# EasyEDA Pro project ProPrj_Anniversary_2026-05-06.epro, board PCB1_1
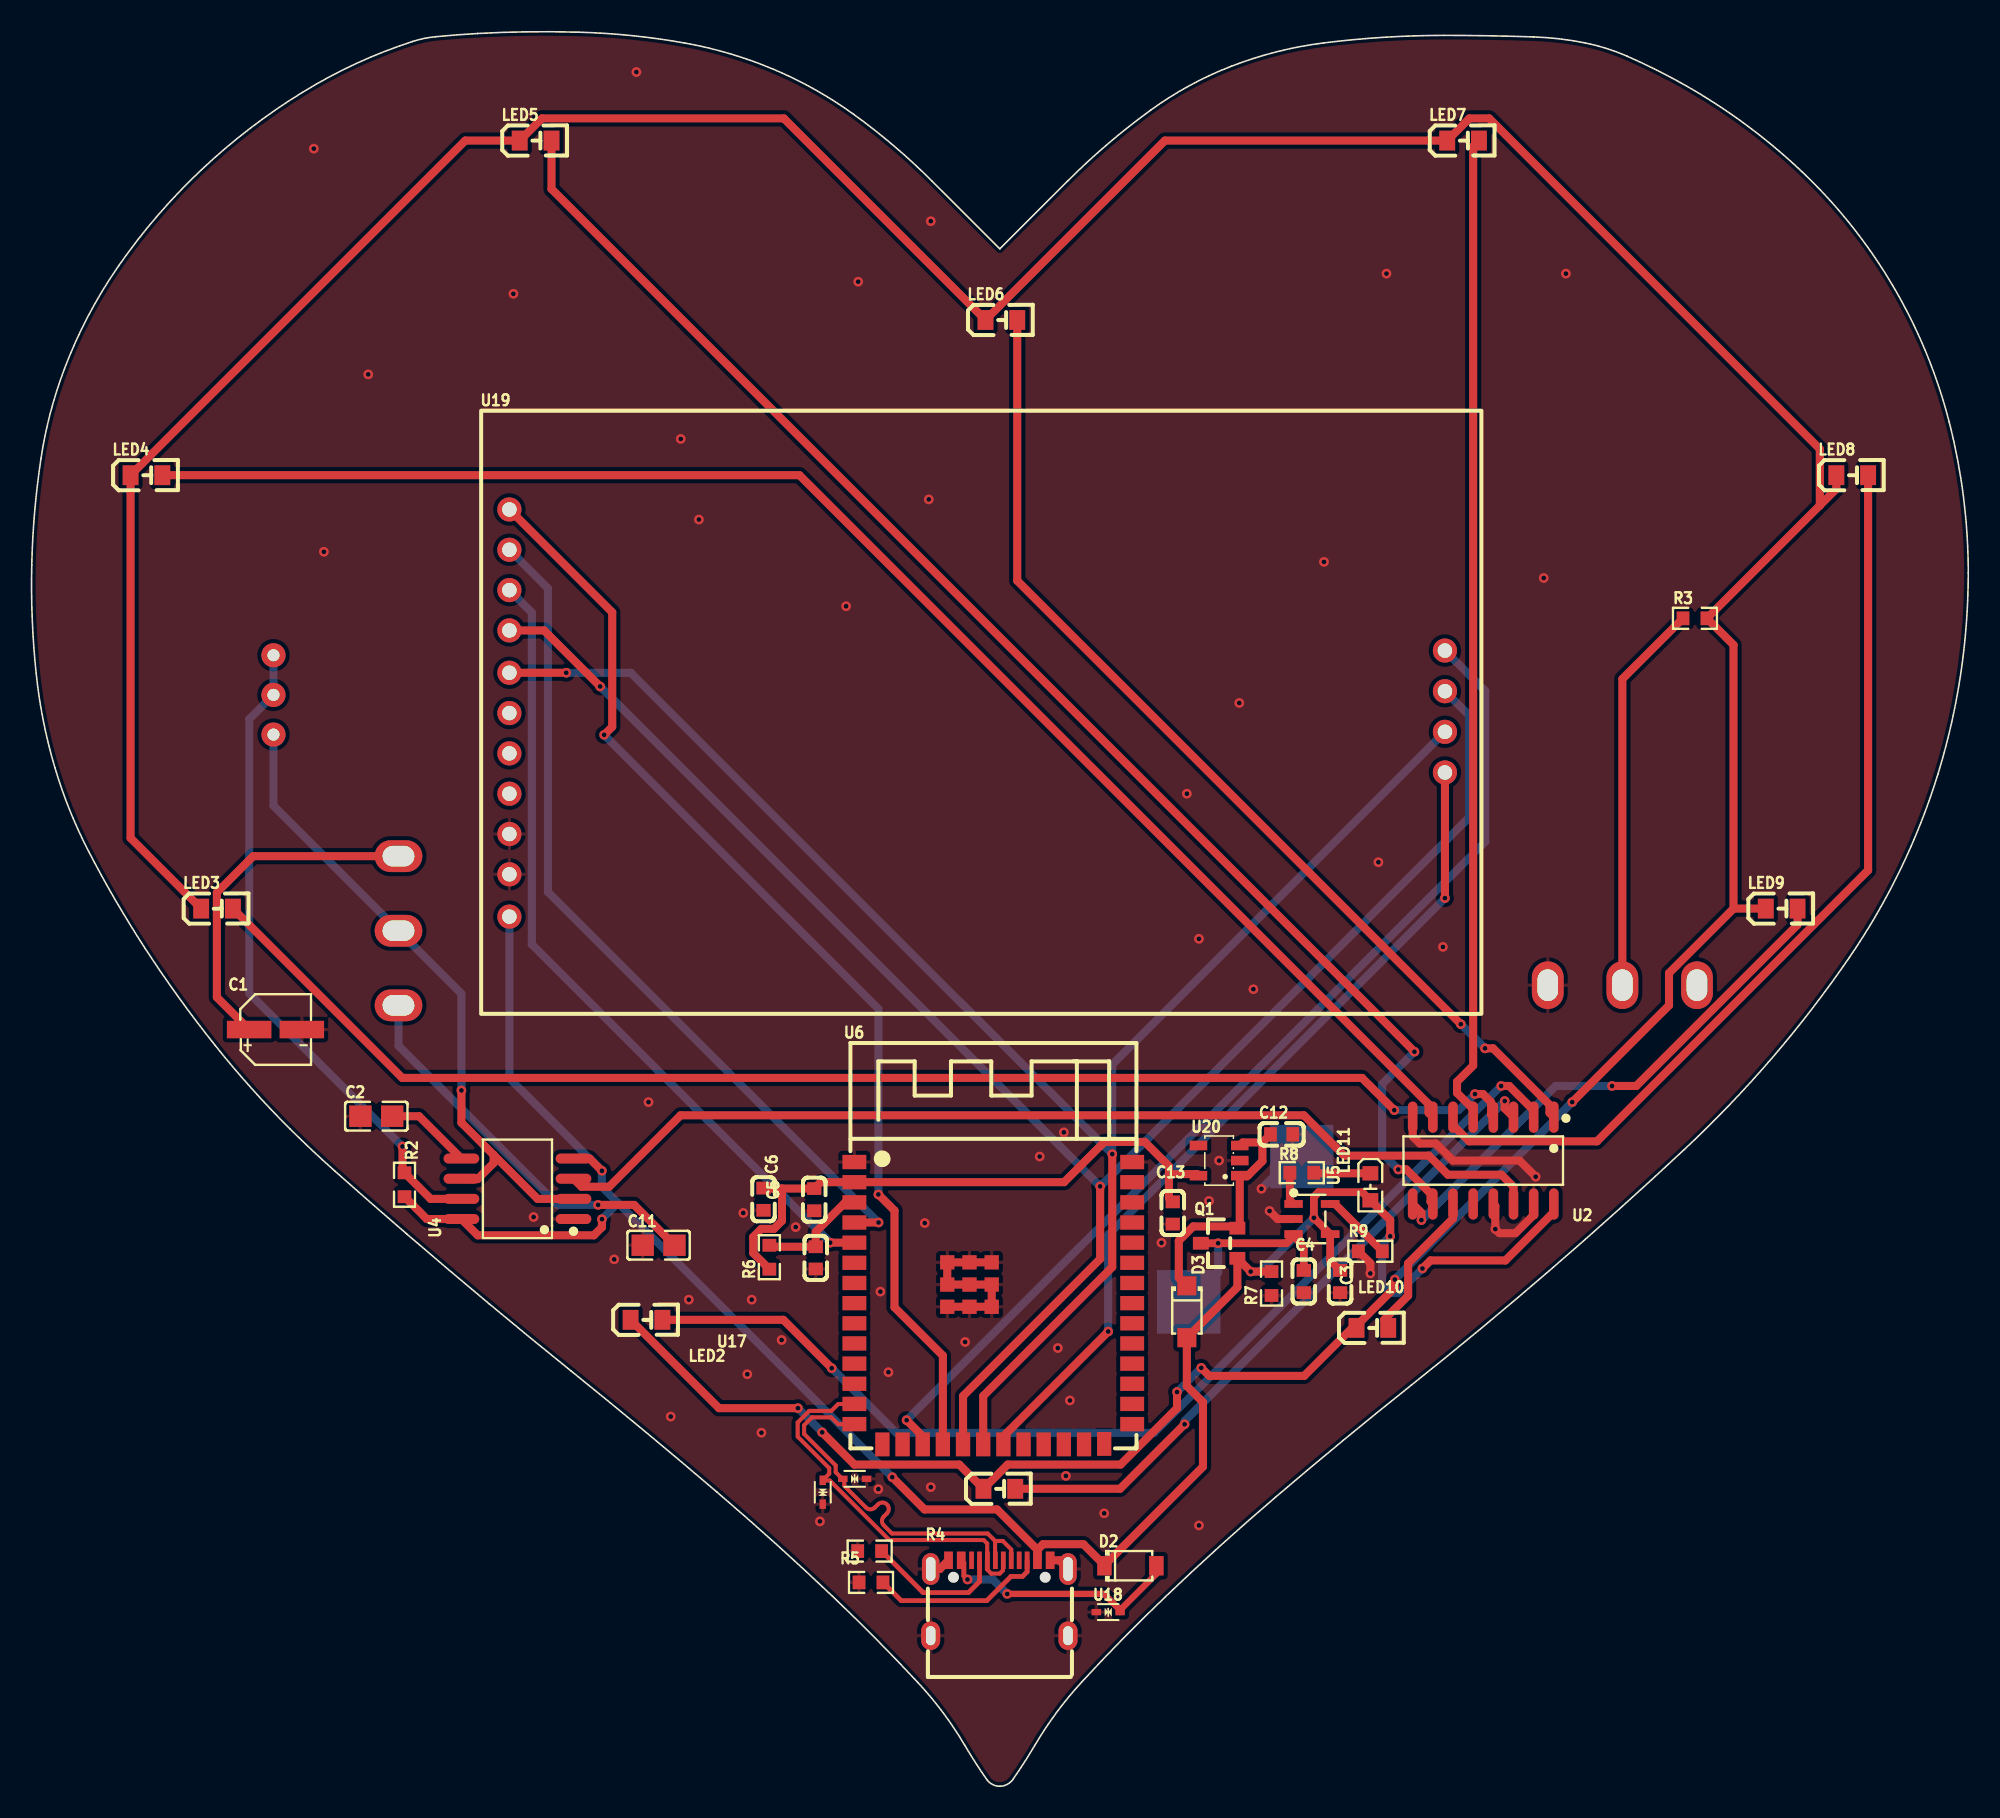
[diagram p7: board, top side]
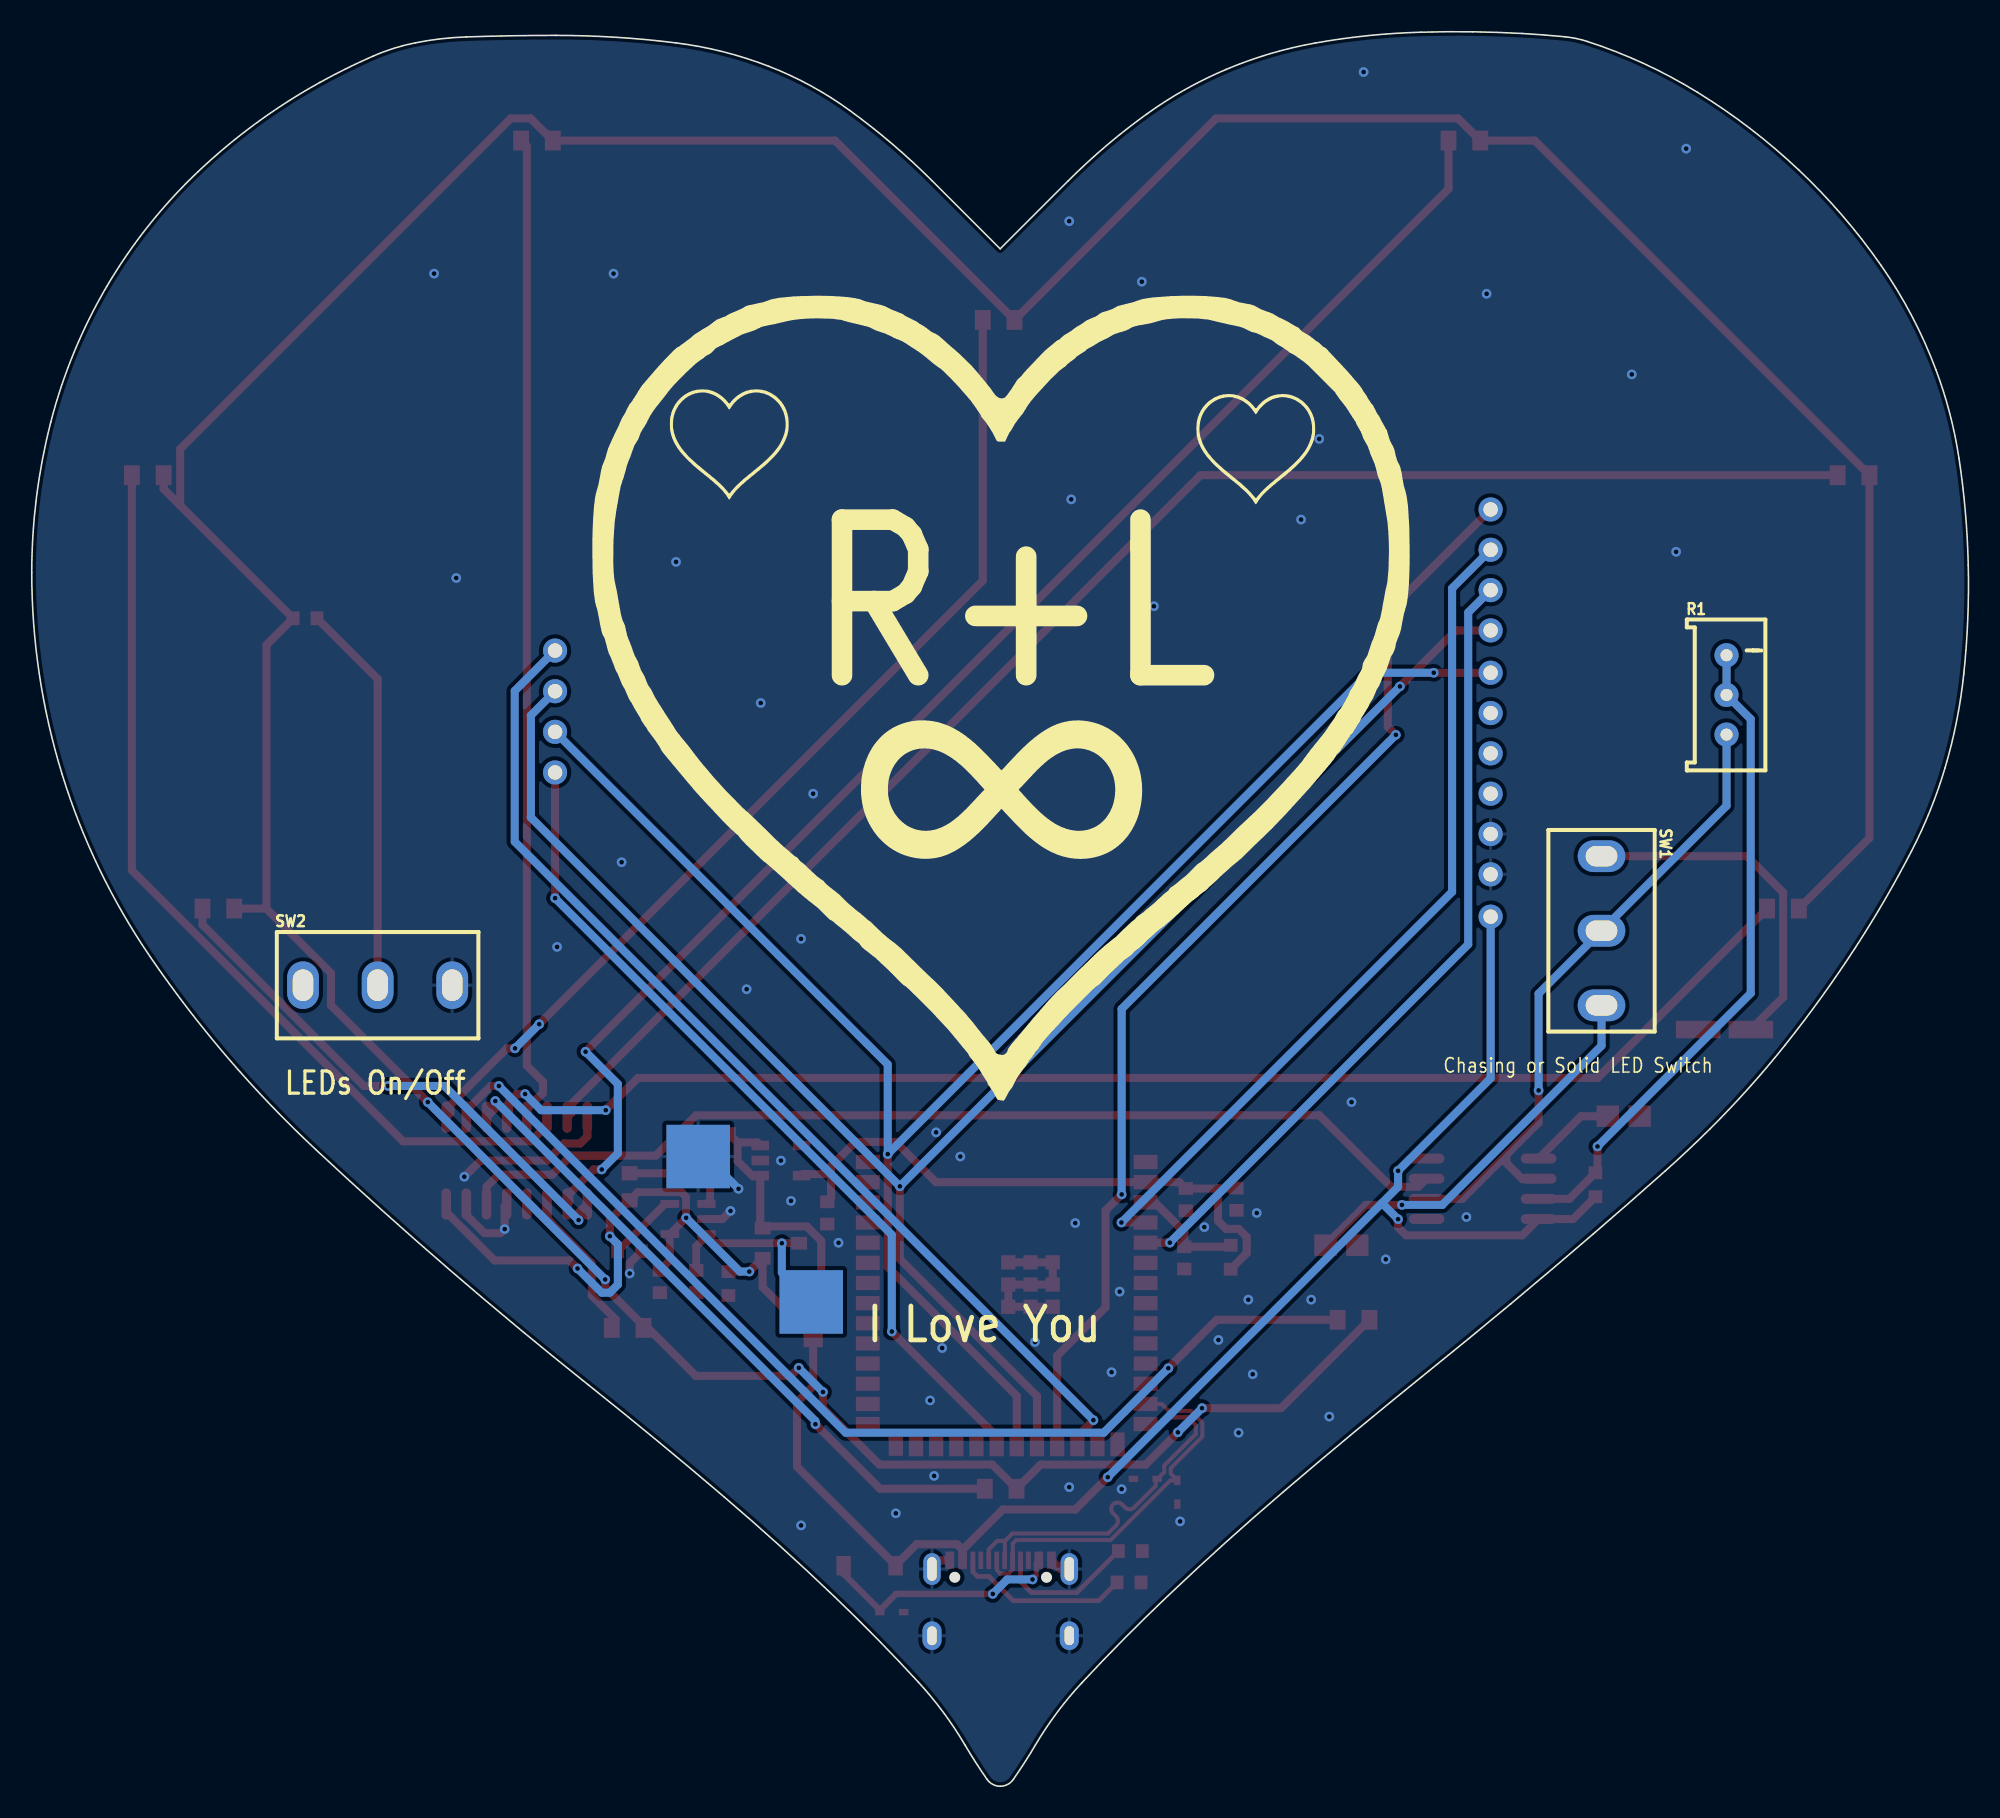
[diagram p8: board, bottom side, seen from below]

Outline 121.97 x 110.54 mm; copper layers: Top Layer, Bottom Layer. Coordinates in mm from the lower left corner of the outline.
Outline path: 0,76.94 arc(0.18,80.31) 0.58,83.67 arc(1.16,86.48) 2.03,89.22 arc(3.55,92.63) 5.49,95.82 arc(7.93,98.96) 10.69,101.84 arc(13.75,104.45) 17.06,106.72 arc(20.42,108.53) 23.97,109.92 arc(24.69,110.11) 25.42,110.22 arc(26.75,110.34) 28.09,110.43 arc(29.66,110.5) 31.23,110.53 arc(32.85,110.54) 34.47,110.51 arc(37.81,110.29) 41.13,109.83 arc(43.98,109.15) 46.73,108.17 arc(49.33,106.9) 51.76,105.34 arc(54.31,103.34) 56.7,101.14 60.97,96.86 65.25,101.14 arc(67.77,103.47) 70.47,105.6 arc(72.93,107.15) 75.56,108.37 arc(78.44,109.28) 81.4,109.84 arc(85.18,110.19) 88.97,110.31 arc(91.79,110.28) 94.61,110.21 arc(96.22,110.09) 97.82,109.84 arc(99.17,109.49) 100.48,109 arc(102.17,108.21) 103.82,107.34 arc(107.85,104.77) 111.52,101.7 arc(114.64,98.3) 117.25,94.48 arc(119.31,90.34) 120.77,85.95 arc(121.67,81.24) 121.97,76.45 arc(121.49,70.03) 120.06,63.75 arc(117.71,57.77) 114.49,52.22 arc(109.62,45.88) 104.09,40.12 arc(95.64,32.53) 86.9,25.28 arc(82.61,21.79) 78.37,18.24 arc(74.85,15.14) 71.41,11.95 arc(68.74,9.3) 66.15,6.58 arc(64.57,4.67) 63.2,2.61 arc(62.52,1.51) 61.8,0.43 arc(61.44,0.12) 60.98,0 arc(60.51,0.11) 60.15,0.43 arc(59.43,1.5) 58.76,2.6 arc(57.4,4.64) 55.82,6.53 arc(53.17,9.29) 50.44,11.97 arc(46.85,15.29) 43.17,18.52 arc(38.6,22.38) 33.97,26.16 arc(31.38,28.27) 28.81,30.4 arc(26.21,32.59) 23.62,34.79 arc(21.35,36.77) 19.09,38.76 arc(17.67,40.06) 16.28,41.4 arc(13.84,43.97) 11.55,46.68 arc(9.27,49.67) 7.15,52.78 arc(5.29,55.79) 3.59,58.89 arc(2.4,61.48) 1.46,64.17 arc(0.73,67.1) 0.28,70.09 arc(0.03,73.51) 0,76.94
Stack: Top Layer 0.035mm / Dielectric1 1.51mm FR4 er 4.5 / Bottom Layer 0.035mm

## Design rules (mm)
net D-: DP1
net D+: DP1
template: Custom Config
spacing copperThickness1oz (default): track to track 0.102, other pairs 0.152 to 0.3
spacing copperThickness2oz: track to track 0.203, other pairs 0.152 to 0.3
track width copperThickness1oz (default): min 0.127, default 0.508, max 2.54
track width copperThickness2oz: min 0.203, default 0.254, max 2.54
differential pair differentialPair (default): width min 0.127, default 0.254, max 2.54; gap min 0.152, default 0.152
via viaSize (default): diameter min 0.5, default 0.61, max 10; hole min 0.3, default 0.305, max 6.3

## Placement (name value [footprint] x y rotation side)
C1  1uF  [CAP-SMD_BD4.0-L4.3-W4.3-FD]  15.35 47.67 0 top
C2  10nF  [C0805]  21.7 42.21 0 top
C3  4.7uF  [C0603]  82.41 31.8 270 top
C4  4.7uF  [C0603]  80.12 31.8 270 top
C5  22uF  [C0603]  46.09 36.98 270 top
C6  100nF  [C0603]  49.29 36.96 270 top
C7  1uF  [C0603]  49.38 33.29 270 top
C11  10nF  [C0805]  39.48 34.09 0 top
C12  2.2uF  [C0603]  78.73 41.07 0 top
C13  2.2uF  [C0603]  71.87 36.12 270 top
D2  1N5819HW-7-F  [SOD-123_L2.7-W1.6-LS3.7-RD]  69.2 13.89 0 top
D3  1N4007 A7  [SOD-123FL_L2.7-W1.8-LS3.8-RD]  72.76 29.89 270 top
LED1  XL-2012SURC  [LED0805-RD_RED]  60.95 18.74 0 top
LED2  XL-2012SURC  [LED0805-RD_RED]  38.72 29.39 0 top
LED3  XL-2012SURC  [LED0805-RD_RED]  11.67 55.29 0 top
LED4  XL-2012SURC  [LED0805-RD_RED]  7.22 82.6 0 top
LED5  XL-2012SURC  [LED0805-RD_RED]  31.74 103.68 0 top
LED6  XL-2012SURC  [LED0805-RD_RED]  61.07 92.38 0 top
LED7  XL-2012SURC  [LED0805-RD_RED]  90.16 103.68 0 top
LED8  XL-2012SURC  [LED0805-RD_RED]  114.67 82.6 0 top
LED9  XL-2012SURC  [LED0805-RD_RED]  110.22 55.29 0 top
LED10  XL-2012SURC  [LED0805-RD_RED]  84.44 28.88 0 top
LED11  GL0603UR01  [LED0603-FD]  84.31 37.77 90 top
Q1  AO3401A  [SOT-23_L2.9-W1.3-P1.90-LS2.4-BR]  74.79 34.21 0 top
R1  50kΩ  [RES-ADJ-TH_3P-L9.5-W4.85-P2.50-BL-BS]  15.23 68.76 180 bottom
R2  1k  [R0603]  23.48 37.9 270 top
R3  470  [R0603]  104.76 73.58 0 top
R4  5.1K  [R0603]  52.78 14.82 0 top
R5  5.1K  [R0603]  52.86 12.84 0 top
R6  10K  [R0603]  46.46 33.33 90 top
R7  100K  [R0603]  78.09 31.67 90 top
R8  470  [R0603]  80 38.66 0 top
R9  2k  [R0603]  84.31 33.7 0 top
SW1  SS-12D10L5  [SW-TH_SS-12D10L5]  23.1 53.9 270 bottom
SW2  SS-12D10L5  [SW-TH_SS-12D10L5]  100.19 50.47 180 bottom
TP1  -  [Test-Point-0.5mm]  72.88 30.51 180 bottom
TP2  -  [Test-Point-0.5mm]  80 39.67 180 bottom
U2  CD4017BM96  [SOIC-16_L9.9-W3.9-P1.27-LS6.0-BL]  91.43 39.42 180 top
U4  NE555PSR  [SOIC-8_L6.2-W5.3-P1.27-LS8.0-BL]  30.59 37.64 90 top
U5  MCP73831T-2ACI/OT  [SOT-23-5_L3.0-W1.7-P0.95-LS2.8-BL]  80.63 35.74 270 top
U6  2.4GHz  [WIRELM-SMD_ESP32-S3-WROOM-1]  60.56 30.43 0 top
U16  LESD5D5.0CT1G  [SOD-523_L1.2-W0.8-LS1.6-BI]  49.82 18.52 90 top
U17  LESD5D5.0CT1G  [SOD-523_L1.2-W0.8-LS1.6-BI]  51.83 19.37 180 top
U18  LESD5D5.0CT1G  [SOD-523_L1.2-W0.8-LS1.6-BI]  67.8 10.97 0 top
U19  -  [DST TFT]  184.01 -28.53 0 top
U20  TLV73333PDBVR  [SOT-23-5_L3.0-W1.7-P0.95-LS2.8-BR]  74.79 39.42 0 top
USB1  TYPE-C 16PIN 2MD(073)  [USB-C-SMD_TYPE-C-6PIN-2MD-073]  60.95 11.86 0 top

## Footprints (pads in the part's own frame, mm; a bottom-side part is the same pattern mirrored in y, then rotated)
C0603
  rect 0.8x0.9 smd: 1(-0.7,0) 2(0.7,0)
C0805
  rect 1.41x1.35 smd: 1(-1,0) 2(1,0)
CAP-SMD_BD4.0-L4.3-W4.3-FD
  rect 2.8x1.1 smd: 1(-1.661,0) 2(1.661,0)
DST TFT
  round 1.524 hole 0.914: 1(-153.924,108.966) 2(-153.924,106.426) 3(-153.924,103.886) 4(-153.924,101.346) 5(-153.924,98.679) 6(-153.924,96.139) 7(-153.924,93.599) 8(-153.924,91.059) 9(-153.924,88.519) 10(-153.924,85.979) 11(-153.924,83.312) 12(-94.996,100.076) 13(-94.996,97.516) 14(-94.996,94.956) 15(-94.996,92.396)
LED0603-FD
  rect 0.9x1 smd: 1(-0.85,0) 2(0.85,0)
LED0805-RD_RED
  rect 1x1.25 smd: 1(-1,0) 2(1,0)
R0603
  rect 0.806x0.864 smd: 1(-0.753,0) 2(0.753,0)
RES-ADJ-TH_3P-L9.5-W4.85-P2.50-BL-BS
  round 1.524 hole 0.762: 1(0,2.5) 2(0,0) 3(0,-2.5)
SOD-123_L2.7-W1.6-LS3.7-RD
  rect 0.91x1.22 smd: 1(-1.635,0) 2(1.635,0)
SOD-123FL_L2.7-W1.8-LS3.8-RD
  rect 1.2x1.2 smd: 1(-1.635,0) 2(1.635,0)
SOD-523_L1.2-W0.8-LS1.6-BI
  rect 0.6x0.4 smd: 1(-0.75,0) 2(0.75,0)
SOIC-8_L6.2-W5.3-P1.27-LS8.0-BL
  oval 0.63x2.25 smd: 1(-1.905,-3.53) 2(-0.635,-3.53) 3(0.635,-3.53) 4(1.905,-3.53) 5(1.905,3.53) 6(0.635,3.53) 7(-0.635,3.53) 8(-1.905,3.53)
SOIC-16_L9.9-W3.9-P1.27-LS6.0-BL
  oval 0.602x1.971 smd: 1(-4.445,-2.736) 2(-3.175,-2.736) 3(-1.905,-2.736) 4(-0.635,-2.736) 5(0.635,-2.736) 6(1.905,-2.736) 7(3.175,-2.736) 8(4.445,-2.736) 9(4.445,2.736) 10(3.175,2.736) 11(1.905,2.736) 12(0.635,2.736) 13(-0.635,2.736) 14(-1.905,2.736) 15(-3.175,2.736) 16(-4.445,2.736)
SOT-23-5_L3.0-W1.7-P0.95-LS2.8-BL
  rect 0.49x1.157 smd: 1(-0.95,-1.153) 2(0,-1.153) 3(0.95,-1.153)
  rect 0.49x1.175 smd: 4(0.95,1.153) 5(-0.95,1.153)
SOT-23-5_L3.0-W1.7-P0.95-LS2.8-BR
  rect 1.1x0.6 smd: 1(1.3,-0.95) 2(1.3,0) 3(1.3,0.95) 4(-1.3,0.95) 5(-1.3,-0.95)
SOT-23_L2.9-W1.3-P1.90-LS2.4-BR
  rect 1x0.8 smd: 1(1.15,-0.95) 2(1.15,0.95) 3(-1.15,0)
SW-TH_SS-12D10L5
  oval 2x3 hole 1.3x2: 1(-4.7,0) 2(0,0) 3(4.7,0)
Test-Point-0.5mm
  rect 4x4 smd: 1(0,0)
USB-C-SMD_TYPE-C-6PIN-2MD-073
  rect 0.55x1.1 smd: 1(-3.2,2.375) 2(-2.4,2.375) 11(2.4,2.375) 12(3.2,2.375)
  rect 0.3x1.1 smd: 3(-1.75,2.375) 4(-1.25,2.375) 5(-0.75,2.375) 6(-0.25,2.375) 7(0.25,2.375) 8(0.75,2.375) 9(1.25,2.375) 10(1.75,2.375)
  oval 1.1x2 hole 0.6x1.5: 13(-4.325,1.825) 14(4.325,1.825)
  oval 1.2x1.8 hole 0.6x1.2: 13(-4.325,-2.375) 14(4.325,-2.375)
WIRELM-SMD_ESP32-S3-WROOM-1
  rect 1.5x0.9 smd: 1(-8.75,8.895) 2(-8.75,7.625) 3(-8.75,6.355) 4(-8.75,5.085) 5(-8.75,3.815) 6(-8.75,2.545) 7(-8.75,1.275) 8(-8.75,0.005) 9(-8.75,-1.265) 10(-8.75,-2.535) 11(-8.75,-3.805) 12(-8.75,-5.075) 13(-8.75,-6.345) 14(-8.75,-7.615) 27(8.75,-7.615) 28(8.75,-6.345) 29(8.75,-5.075) 30(8.75,-3.805) 31(8.75,-2.535) 32(8.75,-1.265) 33(8.75,0.005) 34(8.75,1.275) 35(8.75,2.545) 36(8.75,3.815) 37(8.75,5.085) 38(8.75,6.355) 39(8.75,7.625) 40(8.75,8.895)
  rect 0.9x1.5 smd: 15(-6.985,-8.895) 16(-5.715,-8.895) 17(-4.445,-8.895) 18(-3.175,-8.895) 19(-1.905,-8.895) 20(-0.635,-8.895) 21(0.635,-8.895) 22(1.905,-8.895) 23(3.175,-8.895) 24(4.445,-8.895) 25(5.715,-8.895) 26(6.985,-8.865)
  rect 0.9x0.9 smd: 41(-2.9,2.575) 41(-2.9,1.175) 41(-2.9,-0.225) 41(-1.5,2.575) 41(-1.5,1.175) 41(-1.5,-0.225) 41(-0.1,2.575) 41(-0.1,1.175) 41(-0.1,-0.225)

## Nets
As in the schematic.

Pads without a net: SW2 1; U2 12; U6 6 7 8 9 10 11 15 16 22 23 24 25 26 28 29 30 31 32 33 34 35 36 37 38 39; U19 6 7 8; U20 4; USB1 3 9

## Via types
v1: diameter 0.61, hole 0.305, Top Layer to Bottom Layer, 96 vias

## Routing (per net, layer and track width the routed paths; a pad name or vN(x,y) marks a point on that pad's centre or on a via; arc(x,y) is an arc through that point)
3V3: length 38.4
  Top Layer w0.508: C13.1 71.63,37.06 71.63,38.57 ; 47.25,37.66 47.25,35.62 46.75,35.12 45.95,35.12 45.44,34.61 45.44,33.59 R6.1 ; 47.25,37.66 C6.1 49.69,38.06 U6.2 65.02,38.06 67.56,40.6 70.1,40.6 71.63,39.07 71.63,38.57 ; 47.25,37.66 46.12,37.66 C5.1 ; 71.63,38.57 73.39,38.57 73.49,38.47
+5V: length 140.1
  Top Layer w0.49: LED11.1 83.81,37.43 81.05,37.43 80.76,37.13 v1(80.76,35.81) U5.4 81.78,33.13 C3.1
  Top Layer w0.508: U4.4 35.14,39.55 v1(35.91,38.78) ; 63.35,14.9 USB1.11 ; 63.35,14.9 60.81,17.44 56.23,17.44 v1(54.2,19.47) ; 63.35,14.9 63.7,15.25 66.24,15.25 67.57,13.92 ; R2.2 24.89,35.74 U4.8 28.09,34.71 35.41,34.71 35.91,35.22 v1(35.91,35.73) ; 67.57,13.92 73.77,20.13 73.77,24.2 72.76,25.21 D3.2 75.94,31.44 Q1.1 v1(76.77,32.43) R7.2 ; 67.57,13.92 D2.1 ; v1(85.56,34.65) 85.56,35.67 LED11.1 ; U2.16 95.87,36.18 92.82,33.13 88.1,33.13 v1(87.6,32.62)
  Bottom Layer w0.508: 36.93,36.74 v1(35.91,35.73) ; 36.93,36.74 35.91,37.76 v1(35.91,38.78) 30.08,44.6 30.08,54.79 ; 36.93,36.74 v1(54.2,19.47) ; v1(85.56,34.65) 85.06,34.14 85.06,31.6 85.56,31.1 86.07,31.1 v1(87.6,32.62) ; v1(80.76,35.81) 77.37,32.43 v1(76.77,32.43)
GND: length 36.1
  Top Layer w0.508: USB1.12 64.72,14.24 USB1.14 ; USB1.13 57.2,13.69 USB1.1 ; v1(94.73,38.4) 93.71,39.42 89.52,39.42 88.44,40.5 87.42,40.5 86.98,40.94 U2.8 ; 92.06,36.68 92.19,36.56 v1(92.19,35.1) 92.44,34.85 93.46,34.85 94.6,35.99 U2.15 ; v1(84.31,32.31) 84.31,32.95 R9.1 ; U6.41 U6.41 U6.41 U6.41 U6.41 U6.41 U6.41 U6.41 U6.41 ; v1(77.96,36.24) 78.47,35.74 U5.2
  Bottom Layer w0.508: TP2.1 79.49,39.67 v1(77.46,37.64)
  vias: v1(17.77,103.17) v1(18.4,77.77) v1(21.19,88.95) v1(30.34,94.03) v1(31.61,35.86) v1(36.69,33.2) v1(38.09,108) v1(38.85,43.1) v1(40.24,23.29) v1(40.88,84.89) v1(41.39,30.66) v1(42.02,79.81) v1(44.82,36.12) v1(45.07,25.96) v1(45.35,30.66) v1(45.96,22.27) v1(47.23,28.12) v1(48.12,35.23) v1(49.64,16.69) v1(51.29,74.34) v1(52.06,94.79) v1(53.33,18.72) v1(53.45,31.16) v1(53.96,26.08) v1(56.25,35.48) v1(56.5,81.08) v1(56.63,98.6) v1(56.63,18.85) v1(58.79,27.99) v1(63.49,39.67) v1(64.63,27.61) v1(65.01,41.2) v1(65.14,19.55) v1(65.39,24.31) v1(67.55,17.19) v1(71.16,34.24) v1(72.76,62.53) v1(73.52,53.39) v1(73.52,16.43) v1(74.15,36.88) v1(74.79,39.42) v1(76.06,68.25) v1(76.95,50.21) v1(81.39,77.14) v1(84.82,58.22) v1(85.33,95.3) v1(88.89,52.88) v1(95.24,76.12) v1(96.63,95.3)
VBAT: length 13
  Top Layer w0.49: Q1.3 v1(74.73,34.21) 79.02,34.21 79.48,34.67 ; C4.1 80.12,34.02 79.48,34.67 ; 79.48,34.67 U5.3
  Bottom Layer w0.508: TP1.1 74.73,32.37 v1(74.73,34.21)
VIN: length 15.7
  Top Layer w0.508: U20.3 76.28,40.56 77.52,40.56 ; C12.1 77.52,40.56 ; 77.52,40.56 77.52,39.39 76.6,38.47 U20.1 76.09,35.42 75.94,35.27 ; 75.94,35.27 Q1.2 ; 75.94,35.27 73.16,35.27 72.25,34.36 72.25,32.04 D3.1
0: length 42.3
  Top Layer w0.508: LED1.2 68.55,18.74 v1(72.61,22.81) ; v1(92.78,43.17) 92.78,42.71 U2.3
  Bottom Layer w0.508: v1(92.78,43.17) 72.61,23.01 v1(72.61,22.81)
1: length 67.9
  Top Layer w0.508: v1(50.39,26.34) 47.34,29.39 LED2.2 ; U2.2 94.58,42.17 94.58,42.59 93.06,44.12 v1(92.55,44.12)
  Bottom Layer w0.508: v1(92.55,44.12) 70.71,22.27 54.45,22.27 v1(50.39,26.34)
2: length 86.1
  Top Layer w0.508: v1(90.9,43.61) 91.41,43.61 91.92,43.1 91.92,42.3 92.06,42.16 ; v1(85.82,42.59) 83.79,44.63 23.34,44.63 LED3.2
  Bottom Layer w0.508: v1(90.9,43.61) 89.89,42.59 v1(85.82,42.59)
3: length 97.1
  Top Layer w0.508: LED4.2 48.36,82.6 87.98,42.98 87.98,42.42 U2.7
4: length 92
  Top Layer w0.508: U2.10 88.11,36.83 88.11,37.34 86.58,38.86 v1(86.08,38.86) ; v1(87.09,46.28) 32.74,100.63 LED5.2
  Bottom Layer w0.508: v1(87.09,46.28) 85.06,44.25 85.06,39.88 v1(86.08,38.86)
5: length 64.5
  Top Layer w0.508: LED6.2 62.07,75.95 v1(90.01,48.01) ; U2.1 95.6,42.42 95.6,42.93 92.04,46.49 v1(91.54,46.49)
  Bottom Layer w0.508: v1(90.01,48.01) v1(91.54,46.49)
6: length 62.5
  Top Layer w0.508: U2.5 90.79,42.66 89.77,43.68 89.77,44.39 90.79,45.4 90.79,103.32 LED7.2
7: length 59
  Top Layer w0.508: U2.6 89.52,41.65 90.54,40.63 98.59,40.63 115.67,57.71 LED8.2
8: length 33.7
  Top Layer w0.508: v1(99.54,44.12) 101.06,44.12 111.22,54.28 LED9.2 ; U2.9 87.53,36.13 v1(87.53,35.67)
  Bottom Layer w0.508: v1(87.53,35.67) 95.98,44.12 v1(99.54,44.12)
9: length 9.1
  Top Layer w0.508: 85.17,29.39 86.69,30.91 86.69,32.94 89.52,35.77 U2.11
A0: length 51
  Top Layer w0.508: U6.5 v1(50.29,34.25)
  Bottom Layer w0.508: v1(50.29,34.25) 31.49,53.04 31.49,73.95 30.08,75.36
CS: length 70.6
  Top Layer w0.508: v1(53.33,37.29) 54.34,36.27 54.34,30.17 57.39,27.13 U6.18 ; v1(36.05,66.24) 36.56,66.75 36.56,73.96 30.08,80.44
  Bottom Layer w0.508: v1(36.05,66.24) 53.33,48.97 v1(53.33,37.29)
D+: length 23.9
  Top Layer w0.254: 60.68,15.45 60.21,15.92 54.18,15.92 53.67,16.43 arc(53.55,16.71) 53.67,17 53.87,17.19 arc(53.87,17.76) 53.3,17.76 53.11,17.56 arc(52.82,17.45) 52.54,17.56 51.18,18.92 51.18,19.24 50.64,19.78 50.64,20.21 48.65,22.2 48.65,22.75 49.14,23.24 50.36,23.24 50.79,22.81 51.8,22.81 ; 60.68,15.45 60.68,15.16 ; 60.68,15.45 61.16,15.45 61.7,14.92 USB1.8 ; 60.68,15.09 60.68,14.23
D-: length 23.9
  Top Layer w0.254: 51.8,24.08 50.79,24.08 50.36,23.65 48.97,23.65 48.24,22.92 48.24,22.03 50.23,20.04 50.23,19.69 49.8,19.26 50.26,19.26 54.01,15.52 54.03,15.52 54.04,15.51 59.96,15.51 60.18,15.29 60.18,14.23 60.16,14.21 60.16,13.67 60.44,13.4 60.97,13.4 61.18,13.6 61.18,13.93
EN: length 7.1
  Top Layer w0.508: R6.2 46.55,33.99 C7.1 49.38,34.93 51.24,36.79 51.81,36.79
OUT: length 64.2
  Top Layer w0.508: U4.3 34.63,37.77 36.37,37.77 40.87,42.27 80.12,42.27 82.66,39.73 88,39.73 89.2,38.53 92.57,38.53 93.33,37.77 U2.14
RESET: length 53.5
  Top Layer w0.508: U6.4 v1(53.34,35.52)
  Bottom Layer w0.508: v1(53.34,35.52) 32.51,56.35 32.51,75.47 30.08,77.9
SCK: length 107.5
  Top Layer w0.508: v1(68.06,39.83) 68.06,32.71 59.93,24.59 U6.20 ; v1(33.67,70.15) 30.08,70.15
  Bottom Layer w0.508: v1(33.67,70.15) 37.73,70.15 v1(68.06,39.83) 68.06,45.48 U19.14
SD_CS: length 66.6
  Top Layer w0.508: v1(55.1,23.06) 56.12,22.05 U6.17
  Bottom Layer w0.508: v1(55.1,23.06) 91.55,59.51 91.55,69.01 U19.12
SD_MISO: length 53.9
  Top Layer w0.508: v1(67.8,28.65) 61.2,22.05 U6.21 ; v1(89.01,55.95) U19.15
  Bottom Layer w0.508: v1(67.8,28.65) 67.8,34.75 v1(89.01,55.95)
SDA_MOSI: length 113
  Top Layer w0.508: v1(35.8,69.29) 32.27,72.82 30.08,72.82 ; U6.19 58.66,24.59 67.3,33.22 v1(67.3,37.79)
  Bottom Layer w0.508: v1(35.8,69.29) v1(67.3,37.79) 90.54,61.03 90.54,67.47 U19.13
TR: length 41.4
  Top Layer w0.508: v1(27.06,43.84) 27.06,41.81 29.09,39.77 ; 29.09,39.77 31.86,37.01 U4.2 ; 29.09,39.77 29.09,39.27 28.08,38.25 27.09,38.25 U4.6
  Bottom Layer w0.508: R1.3 15.23,61.77 SW1.2 27.06,49.93 v1(27.06,43.84)
$1N2239: length 5.5
  Top Layer w0.508: C2.2 24.4,42.21 U4.5
$1N2271: length 41.6
  Top Layer w0.508: v1(23.35,40.31) 23.35,38.78 R2.1 25.12,37.01 U4.7
  Bottom Layer w0.508: v1(23.35,40.31) 13.7,49.96 13.7,67.23 R1.2 R1.1
$1N3321: length 292.5
  Top Layer w0.508: v1(49.79,22.3) 51.82,20.27 58.42,20.27 LED1.1 61.47,20.27 68.58,20.27 72.14,23.82 v1(72.14,24.84) ; LED3.1 6.22,59.74 LED4.1 27.31,103.68 LED5.1 32.13,105.08 47.37,105.08 LED6.1 71.38,103.68 LED7.1 90.55,105.08 91.8,105.08 112.63,84.25 112.63,80.69 ; v1(73.66,26.36) 74.17,25.85 80.15,25.85 83.17,28.88 83.31,28.88 85.85,31.42 v1(85.85,31.93) ; 107.19,55.29 LED9.1 ; 107.19,55.29 103.13,51.23 103.13,49.2 v1(97.03,43.1) ; 107.19,55.29 107.19,71.91 R3.2 112.63,80.69 ; 112.63,80.69 113.67,81.73 LED8.1 ; LED2.1 43.29,23.82 v1(48.26,23.82)
  Bottom Layer w0.508: v1(72.14,24.84) v1(73.66,26.36) ; v1(49.79,22.3) v1(48.26,23.82) ; v1(85.85,31.93) v1(97.03,43.1)
$1N11515: length 21.9
  Top Layer w0.508: SW1.1 13.95,58.6 11.66,56.31 11.66,49.71 C1.1
$1N11545: length 25.1
  Top Layer w0.508: v1(35.67,36.63) 37.94,36.63 C11.2
  Bottom Layer w0.508: SW1.3 23.1,46.66 33.13,36.63 v1(35.67,36.63)
$1N11779: length 24.7
  Top Layer w0.508: R3.1 100.19,69.76 SW2.2
$1N12121: length 15.6
  Top Layer w0.305: v1(58.94,13.03) 58.71,13.26 58.71,14.07 USB1.2
  Top Layer w0.4: v1(61.44,12.12) 67.54,12.12 68.55,11.1 ; 68.55,11.1 70.84,13.38 D2.2 ; 68.55,11.1 U18.2
  Bottom Layer w0.508: v1(61.44,12.12) 60.53,13.03 v1(58.94,13.03)
$1N12126: length 8.9
  Top Layer w0.3: R4.2 56.14,12.2 59,12.2 59.7,12.9 USB1.4
$1N12127: length 11
  Top Layer w0.3: R5.2 54.76,11.7 60.16,11.7 61.68,13.22 62.4,13.22 62.7,13.51 USB1.10
$1N14369: length 3.6
  Top Layer w0.508: R8.2 80.79,38.62 LED11.2
$1N14370: length 2.1
  Top Layer w0.49: U5.1 79.24,36.92 R8.1
$1N14371: length 4.5
  Top Layer w0.49: R9.2 82.08,36.69 U5.5

## Copper pours and planes (outline as drawn; the poured copper is in the pictures)
GND on Top Layer: -1.67,116.51 124.45,116.51 124.45,-1.09 -1.67,-1.09
GND on Bottom Layer: -0.71,118.98 125.4,118.98 125.4,-1.41 -0.71,-1.41

## Text on the board
Bottom Silkscreen Layer: Chasing or Solid LED Switch | LEDs On/Off | I Love You | R+L
